# Altium schematic sheet Block diagram.SchDoc
size A3; SheetNumber: 1; SheetTotal: 3
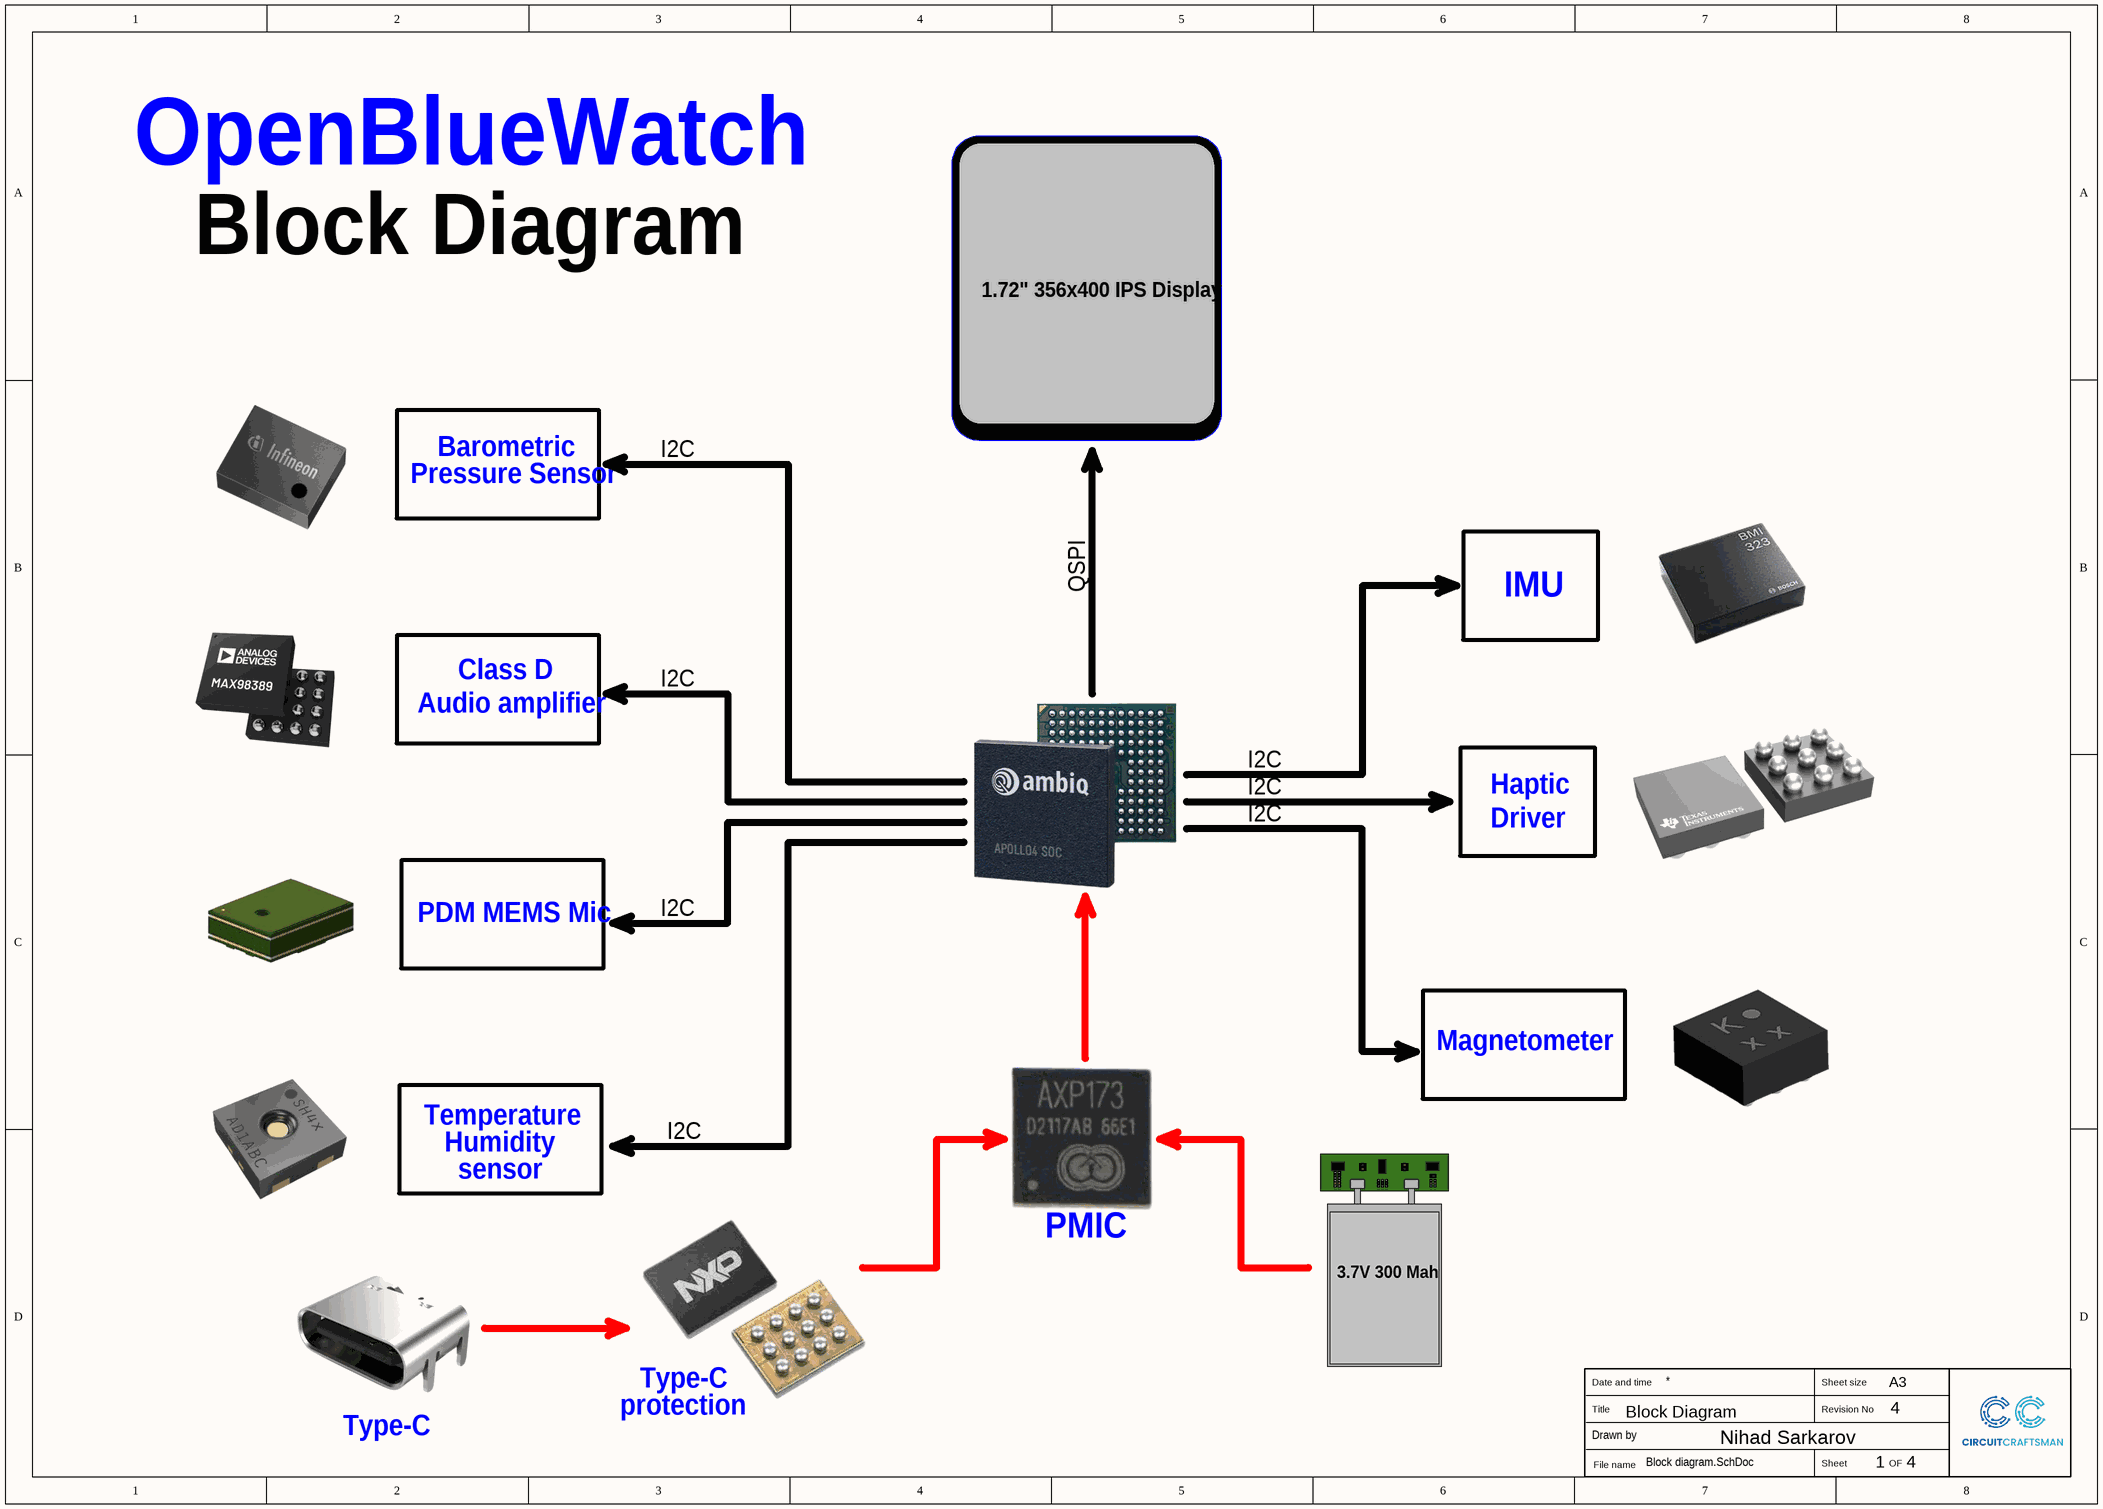
[diagram p0: Block diagram.SchDoc]

## Notes on the sheet
- OpenBlueWatch
- Block Diagram
- 1.72" 356x400 IPS Display
- Pressure Sensor
- Barometric
- I2C
- QSPI
- IMU
- Audio amplifier
- Class D
- Haptic
- Driver
- PDM MEMS Mic
- Magnetometer
- Temperature
- Humidity
- sensor
- PMIC
- 3.7V 300 Mah
- Type-C
- protection
- 4
- 1
- Date and time
- Sheet size
- A3
- Title
- Drawn by
- File name
- Nihad Sarkarov
- Sheet
- Revision No
- OF